# EAGLE schematic LEDWeather (EAGLE 7.5.0)
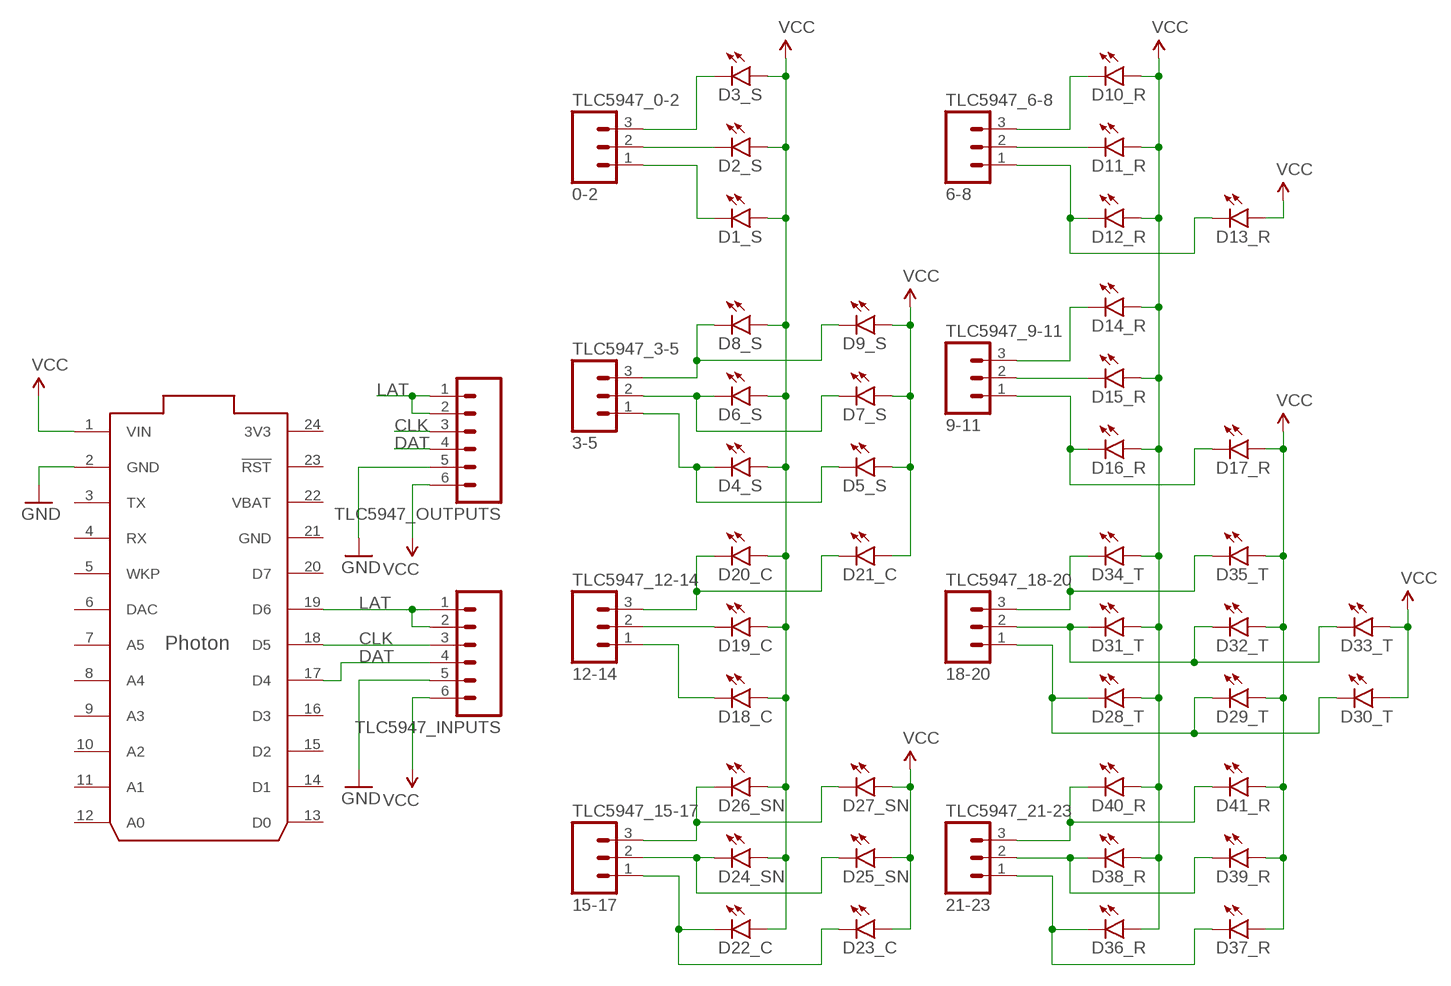
[diagram p0: schematic, sheet 1]

## Parts
D1_S  BRICKLED-1DITTER1  [BRICKLED-1DITTER]
D2_S  BRICKLED-1DITTER1  [BRICKLED-1DITTER]
D3_S  BRICKLED-1DITTER1  [BRICKLED-1DITTER]
D4_S  BRICKLED-1DITTER1  [BRICKLED-1DITTER]
D5_S  BRICKLED-1DITTER1  [BRICKLED-1DITTER]
D6_S  BRICKLED-1DITTER1  [BRICKLED-1DITTER]
D7_S  BRICKLED-1DITTER1  [BRICKLED-1DITTER]
D8_S  BRICKLED-1DITTER1  [BRICKLED-1DITTER]
D9_S  BRICKLED-1DITTER1  [BRICKLED-1DITTER]
D10_R  BRICKLED-1DITTER1  [BRICKLED-1DITTER]
D11_R  BRICKLED-1DITTER1  [BRICKLED-1DITTER]
D12_R  BRICKLED-1DITTER1  [BRICKLED-1DITTER]
D13_R  BRICKLED-1DITTER1  [BRICKLED-1DITTER]
D14_R  BRICKLED-1DITTER1  [BRICKLED-1DITTER]
D15_R  BRICKLED-1DITTER1  [BRICKLED-1DITTER]
D16_R  BRICKLED-1DITTER1  [BRICKLED-1DITTER]
D17_R  BRICKLED-1DITTER1  [BRICKLED-1DITTER]
D18_C  BRICKLED-1DITTER1  [BRICKLED-1DITTER]
D19_C  BRICKLED-1DITTER1  [BRICKLED-1DITTER]
D20_C  BRICKLED-1DITTER1  [BRICKLED-1DITTER]
D21_C  BRICKLED-1DITTER1  [BRICKLED-1DITTER]
D22_C  BRICKLED-1DITTER1  [BRICKLED-1DITTER]
D23_C  BRICKLED-1DITTER1  [BRICKLED-1DITTER]
D24_SN  BRICKLED-1DITTER1  [BRICKLED-1DITTER]
D25_SN  BRICKLED-1DITTER1  [BRICKLED-1DITTER]
D26_SN  BRICKLED-1DITTER1  [BRICKLED-1DITTER]
D27_SN  BRICKLED-1DITTER1  [BRICKLED-1DITTER]
D28_T  BRICKLED-1DITTER1  [BRICKLED-1DITTER]
D29_T  BRICKLED-1DITTER1  [BRICKLED-1DITTER]
D30_T  BRICKLED-1DITTER1  [BRICKLED-1DITTER]
D31_T  BRICKLED-1DITTER1  [BRICKLED-1DITTER]
D32_T  BRICKLED-1DITTER1  [BRICKLED-1DITTER]
D33_T  BRICKLED-1DITTER1  [BRICKLED-1DITTER]
D34_T  BRICKLED-1DITTER1  [BRICKLED-1DITTER]
D35_T  BRICKLED-1DITTER1  [BRICKLED-1DITTER]
D36_R  BRICKLED-1DITTER1  [BRICKLED-1DITTER]
D37_R  BRICKLED-1DITTER1  [BRICKLED-1DITTER]
D38_R  BRICKLED-1DITTER1  [BRICKLED-1DITTER]
D39_R  BRICKLED-1DITTER1  [BRICKLED-1DITTER]
D40_R  BRICKLED-1DITTER1  [BRICKLED-1DITTER]
D41_R  BRICKLED-1DITTER1  [BRICKLED-1DITTER]
TLC5947_0-2  0-2  M031X03_NO_SILK  [1X03_NO_SILK]
TLC5947_3-5  3-5  M031X03_NO_SILK  [1X03_NO_SILK]
TLC5947_6-8  6-8  M031X03_NO_SILK  [1X03_NO_SILK]
TLC5947_9-11  9-11  M031X03_NO_SILK  [1X03_NO_SILK]
TLC5947_12-14  12-14  M031X03_NO_SILK  [1X03_NO_SILK]
TLC5947_15-17  15-17  M031X03_NO_SILK  [1X03_NO_SILK]
TLC5947_18-20  18-20  M031X03_NO_SILK  [1X03_NO_SILK]
TLC5947_21-23  21-23  M031X03_NO_SILK  [1X03_NO_SILK]
TLC5947_INPUTS  M06NO_SILK_FEMALE_PTH  [1X06_NO_SILK]
TLC5947_OUTPUTS  M06NO_SILK_FEMALE_PTH  [1X06_NO_SILK]
U$1  PHOTON_WITH_HEADERS  [PHOTON]

## Nets
CLK: TLC5947_INPUTS.3 TLC5947_OUTPUTS.3 U$1.18(D5)
DAT: TLC5947_INPUTS.4 TLC5947_OUTPUTS.4 U$1.17(D4)
GND: TLC5947_INPUTS.5 TLC5947_OUTPUTS.5 U$1.2(GND)
LAT: TLC5947_INPUTS.1 TLC5947_INPUTS.2 TLC5947_OUTPUTS.1 TLC5947_OUTPUTS.2 U$1.19(D6)
N$1: D10_R.K(C) TLC5947_6-8.3
N$2: D11_R.K(C) TLC5947_6-8.2
N$3: D12_R.K(C) D13_R.K(C) TLC5947_6-8.1
N$5: D14_R.K(C) TLC5947_9-11.3
N$6: D15_R.K(C) TLC5947_9-11.2
N$7: D16_R.K(C) D17_R.K(C) TLC5947_9-11.1
N$9: D34_T.K(C) D35_T.K(C) TLC5947_18-20.3
N$10: D31_T.K(C) D32_T.K(C) D33_T.K(C) TLC5947_18-20.2
N$11: D28_T.K(C) D29_T.K(C) D30_T.K(C) TLC5947_18-20.1
N$17: D40_R.K(C) D41_R.K(C) TLC5947_21-23.3
N$19: D38_R.K(C) D39_R.K(C) TLC5947_21-23.2
N$21: D36_R.K(C) D37_R.K(C) TLC5947_21-23.1
N$23: D3_S.K(C) TLC5947_0-2.3
N$24: D2_S.K(C) TLC5947_0-2.2
N$25: D1_S.K(C) TLC5947_0-2.1
N$26: D8_S.K(C) D9_S.K(C) TLC5947_3-5.3
N$27: D6_S.K(C) D7_S.K(C) TLC5947_3-5.2
N$30: D4_S.K(C) D5_S.K(C) TLC5947_3-5.1
N$32: D20_C.K(C) D21_C.K(C) TLC5947_12-14.3
N$34: D19_C.K(C) TLC5947_12-14.2
N$35: D18_C.K(C) TLC5947_12-14.1
N$36: D26_SN.K(C) D27_SN.K(C) TLC5947_15-17.3
N$37: D24_SN.K(C) D25_SN.K(C) TLC5947_15-17.2
N$38: D22_C.K(C) D23_C.K(C) TLC5947_15-17.1
VCC: D1_S.A D2_S.A D3_S.A D4_S.A D5_S.A D6_S.A D7_S.A D8_S.A D9_S.A D10_R.A D11_R.A D12_R.A D13_R.A D14_R.A D15_R.A D16_R.A D17_R.A D18_C.A D19_C.A D20_C.A D21_C.A D22_C.A D23_C.A D24_SN.A D25_SN.A D26_SN.A D27_SN.A D28_T.A D29_T.A D30_T.A D31_T.A D32_T.A D33_T.A D34_T.A D35_T.A D36_R.A D37_R.A D38_R.A D39_R.A D40_R.A D41_R.A TLC5947_INPUTS.6 TLC5947_OUTPUTS.6 U$1.1(VIN)
Unconnected: U$1.3(TX) U$1.4(RX) U$1.5(WKP) U$1.6(DAC) U$1.7(A5) U$1.8(A4) U$1.9(A3) U$1.10(A2) U$1.11(A1) U$1.12(A0) U$1.13(D0) U$1.14(D1) U$1.15(D2) U$1.16(D3) U$1.20(D7) U$1.23(!RST)

## Power pins joined to a net without a drawn wire
3V3: U$1.24(3V3)
GND: U$1.21(GND)
VBAT: U$1.22(VBAT)

## Library data of the parts
D1_S D2_S D3_S D4_S D5_S D6_S D7_S D8_S D9_S D10_R D11_R D12_R D13_R D14_R D15_R D16_R D17_R D18_C D19_C D20_C D21_C D22_C D23_C D24_SN D25_SN D26_SN D27_SN D28_T D29_T D30_T D31_T D32_T D33_T D34_T D35_T D36_R D37_R D38_R D39_R D40_R D41_R = BrickLED:BRICKLED-1DITTER: One ditter, LEGO compatible LED
TLC5947_0-2 TLC5947_3-5 TLC5947_6-8 TLC5947_9-11 TLC5947_12-14 TLC5947_15-17 TLC5947_18-20 TLC5947_21-23 = SparkFun-Connectors:M03: Header 3 Standard 3-pin 0.1" header. Use with straight break away headers (SKU : PRT-00116), right angle break away headers (PRT-00553), swiss pins (PRT-00743), machine pins (PRT-00117), and female headers (PRT-00115). Molex polarized connector foot print use with SKU : PRT-08232 with associated crimp pins and housings.
TLC5947_INPUTS TLC5947_OUTPUTS = SparkFun-Connectors:M06: Header 6 Standard 6-pin 0.1" header. Use with straight break away headers (SKU : PRT-00116), right angle break away headers (PRT-00553), swiss pins (PRT-00743), machine pins (PRT-00117), and female headers (PRT-00115). Molex polarized connector foot print use with SKU : PRT-08094 with associated crimp pins and housings. NOTES ON THE VARIANTS LOCK and LOCK_LONGPADS... This footprint was designed to help hold the alignment of a through-hole component (i.e. 6-pin header) while soldering it into place. You may notice that each hole has been shifted either up or down by 0.005 of an inch from it's more standard position (which is a perfectly straight line). This slight alteration caused the pins (the squares in the middle) to touch the edges of the holes. Because they are alternating, it causes a "brace" to hold the component in place. 0.005 has proven to be the perfect amount of "off-center" position when using our standard breakaway headers. Although looks a little odd when you look at the bare footprint, once you have a header in there, the alteration is very hard to notice. Also,if you push a header all the way into place, it is covered up entirely on the bottom side. This idea of altering the position of holes to aid alignment will be further integrated into the Sparkfun Library for other footprints. It can help hold any component with 3 or more connection pins.; PROD_ID: CONN-08437
U$1 = Spark:PHOTON